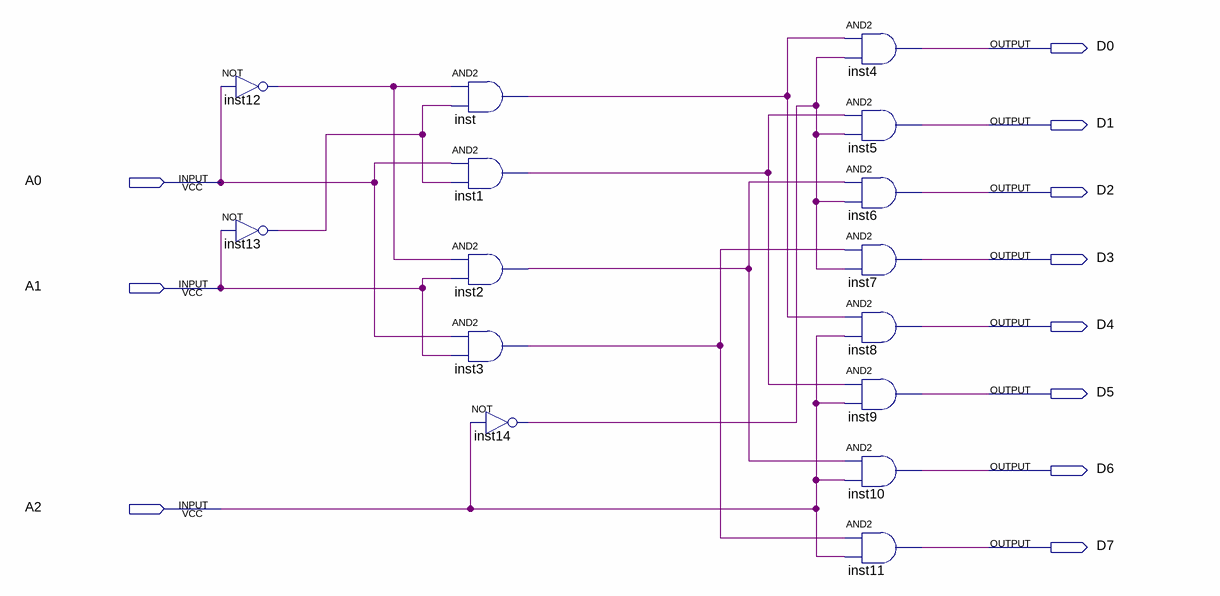
[diagram p0: schematic sheet]
// Quartus schematic zjw.bdf as structural Verilog: 15 symbols, 11 pins
module zjw (
  input  A0,
  input  A1,
  input  A2,
  output D0,
  output D1,
  output D2,
  output D3,
  output D4,
  output D5,
  output D6,
  output D7
);

  wire inst1_out, inst2_out, inst3_out, inst12_out, inst13_out, inst14_out, inst_out;

  not inst12 (inst12_out, A0);
  not inst13 (inst13_out, A1);
  and inst (inst_out, inst12_out, inst13_out);
  and inst1 (inst1_out, A0, inst13_out);
  and inst2 (inst2_out, inst12_out, A1);
  and inst3 (inst3_out, A0, A1);
  not inst14 (inst14_out, A2);
  and inst4 (D0, inst_out, inst14_out);
  and inst5 (D1, inst1_out, inst14_out);
  and inst6 (D2, inst2_out, inst14_out);
  and inst7 (D3, inst3_out, inst14_out);
  and inst8 (D4, inst_out, A2);
  and inst9 (D5, inst1_out, A2);
  and inst10 (D6, inst2_out, A2);
  and inst11 (D7, inst3_out, A2);
endmodule
